# Altium schematic sheet Dispaly_LED.SchDoc
size 50 x 20 mm
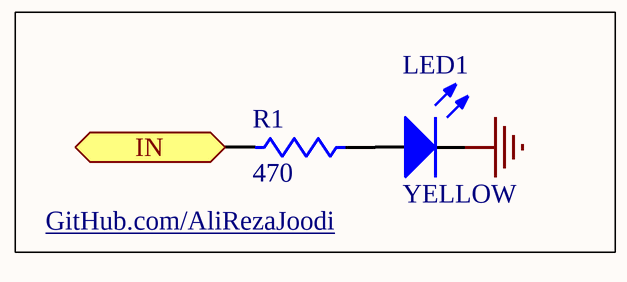
[diagram p0: Dispaly_LED.SchDoc]

## Parts
LED1  YELLOW  [LED-5mm_Red]
R1  470  [AXIAL-0.4]

## Ports
IN (in)

## Nets
GND: LED1.2(K)
IN: R1.2 ; port IN
NetLED1_1: LED1.1(A) R1.1

## Notes on the sheet
- GitHub.com/AliRezaJoodi

## Library data of the parts
LED1 = LED: Typical INFRARED GaAs LED; Manufacturer: Generic Components; Class I: Optoelectronic; Published: 8-Jun-2000; Revision: July-2002: Re-released for DXP Platform.; Publisher: Altium Limited; Class II: LED
R1 = Res1: Resistor; Manufacturer: Generic Components; Class I: Passive; Published: 8-Jun-2000; Revision: July-2002: Re-released for DXP Platform.; Publisher: Altium Limited; Class II: Resistor